# EAGLE schematic CKT señal senoidal como entrada analogica (EAGLE 9.6.2)
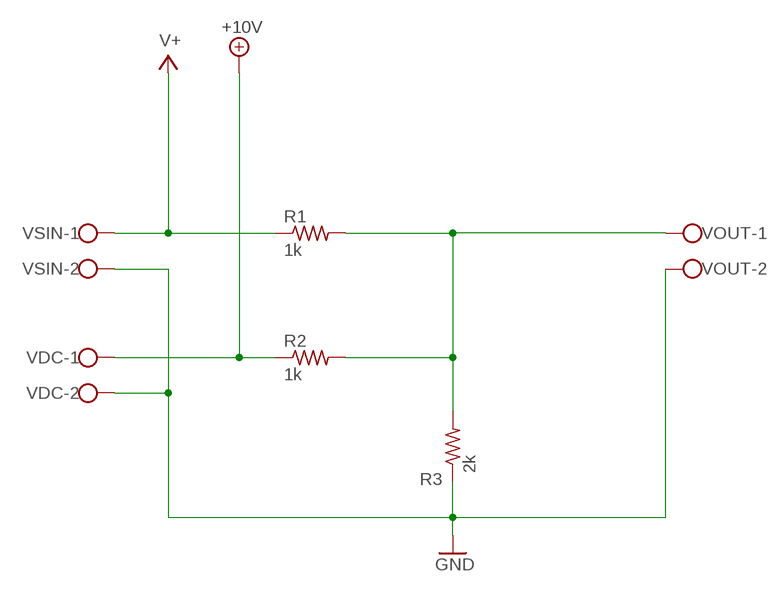
[diagram p0: schematic, sheet 1]

## Parts
R1  1k  R-US_0207/10  [0207/10]
R2  1k  R-US_0207/10  [0207/10]
R3  2k  R-US_0207/10  [0207/10]
VDC  W237-102  [W237-102]
VOUT  W237-102  [W237-102]
VSIN  W237-102  [W237-102]

## Nets
+10V: R2.1 VDC.1
GND: R3.1 VDC.2 VOUT.2 VSIN.2
N$2: R1.2 R2.2 R3.2 VOUT.1
V+: R1.1 VSIN.1

## Library data of the parts
R1-R3 = rcl:R-US_: RESISTOR, American symbol; SPICEPREFIX: R
VDC VOUT VSIN = con-wago-500:W237-102: WAGO SCREW CLAMP; MPN: 237-102; OC_FARNELL: unknown; OC_NEWARK: 70K9898